# EAGLE schematic main (EAGLE 8.5.1)

## Sheet 1 of 2
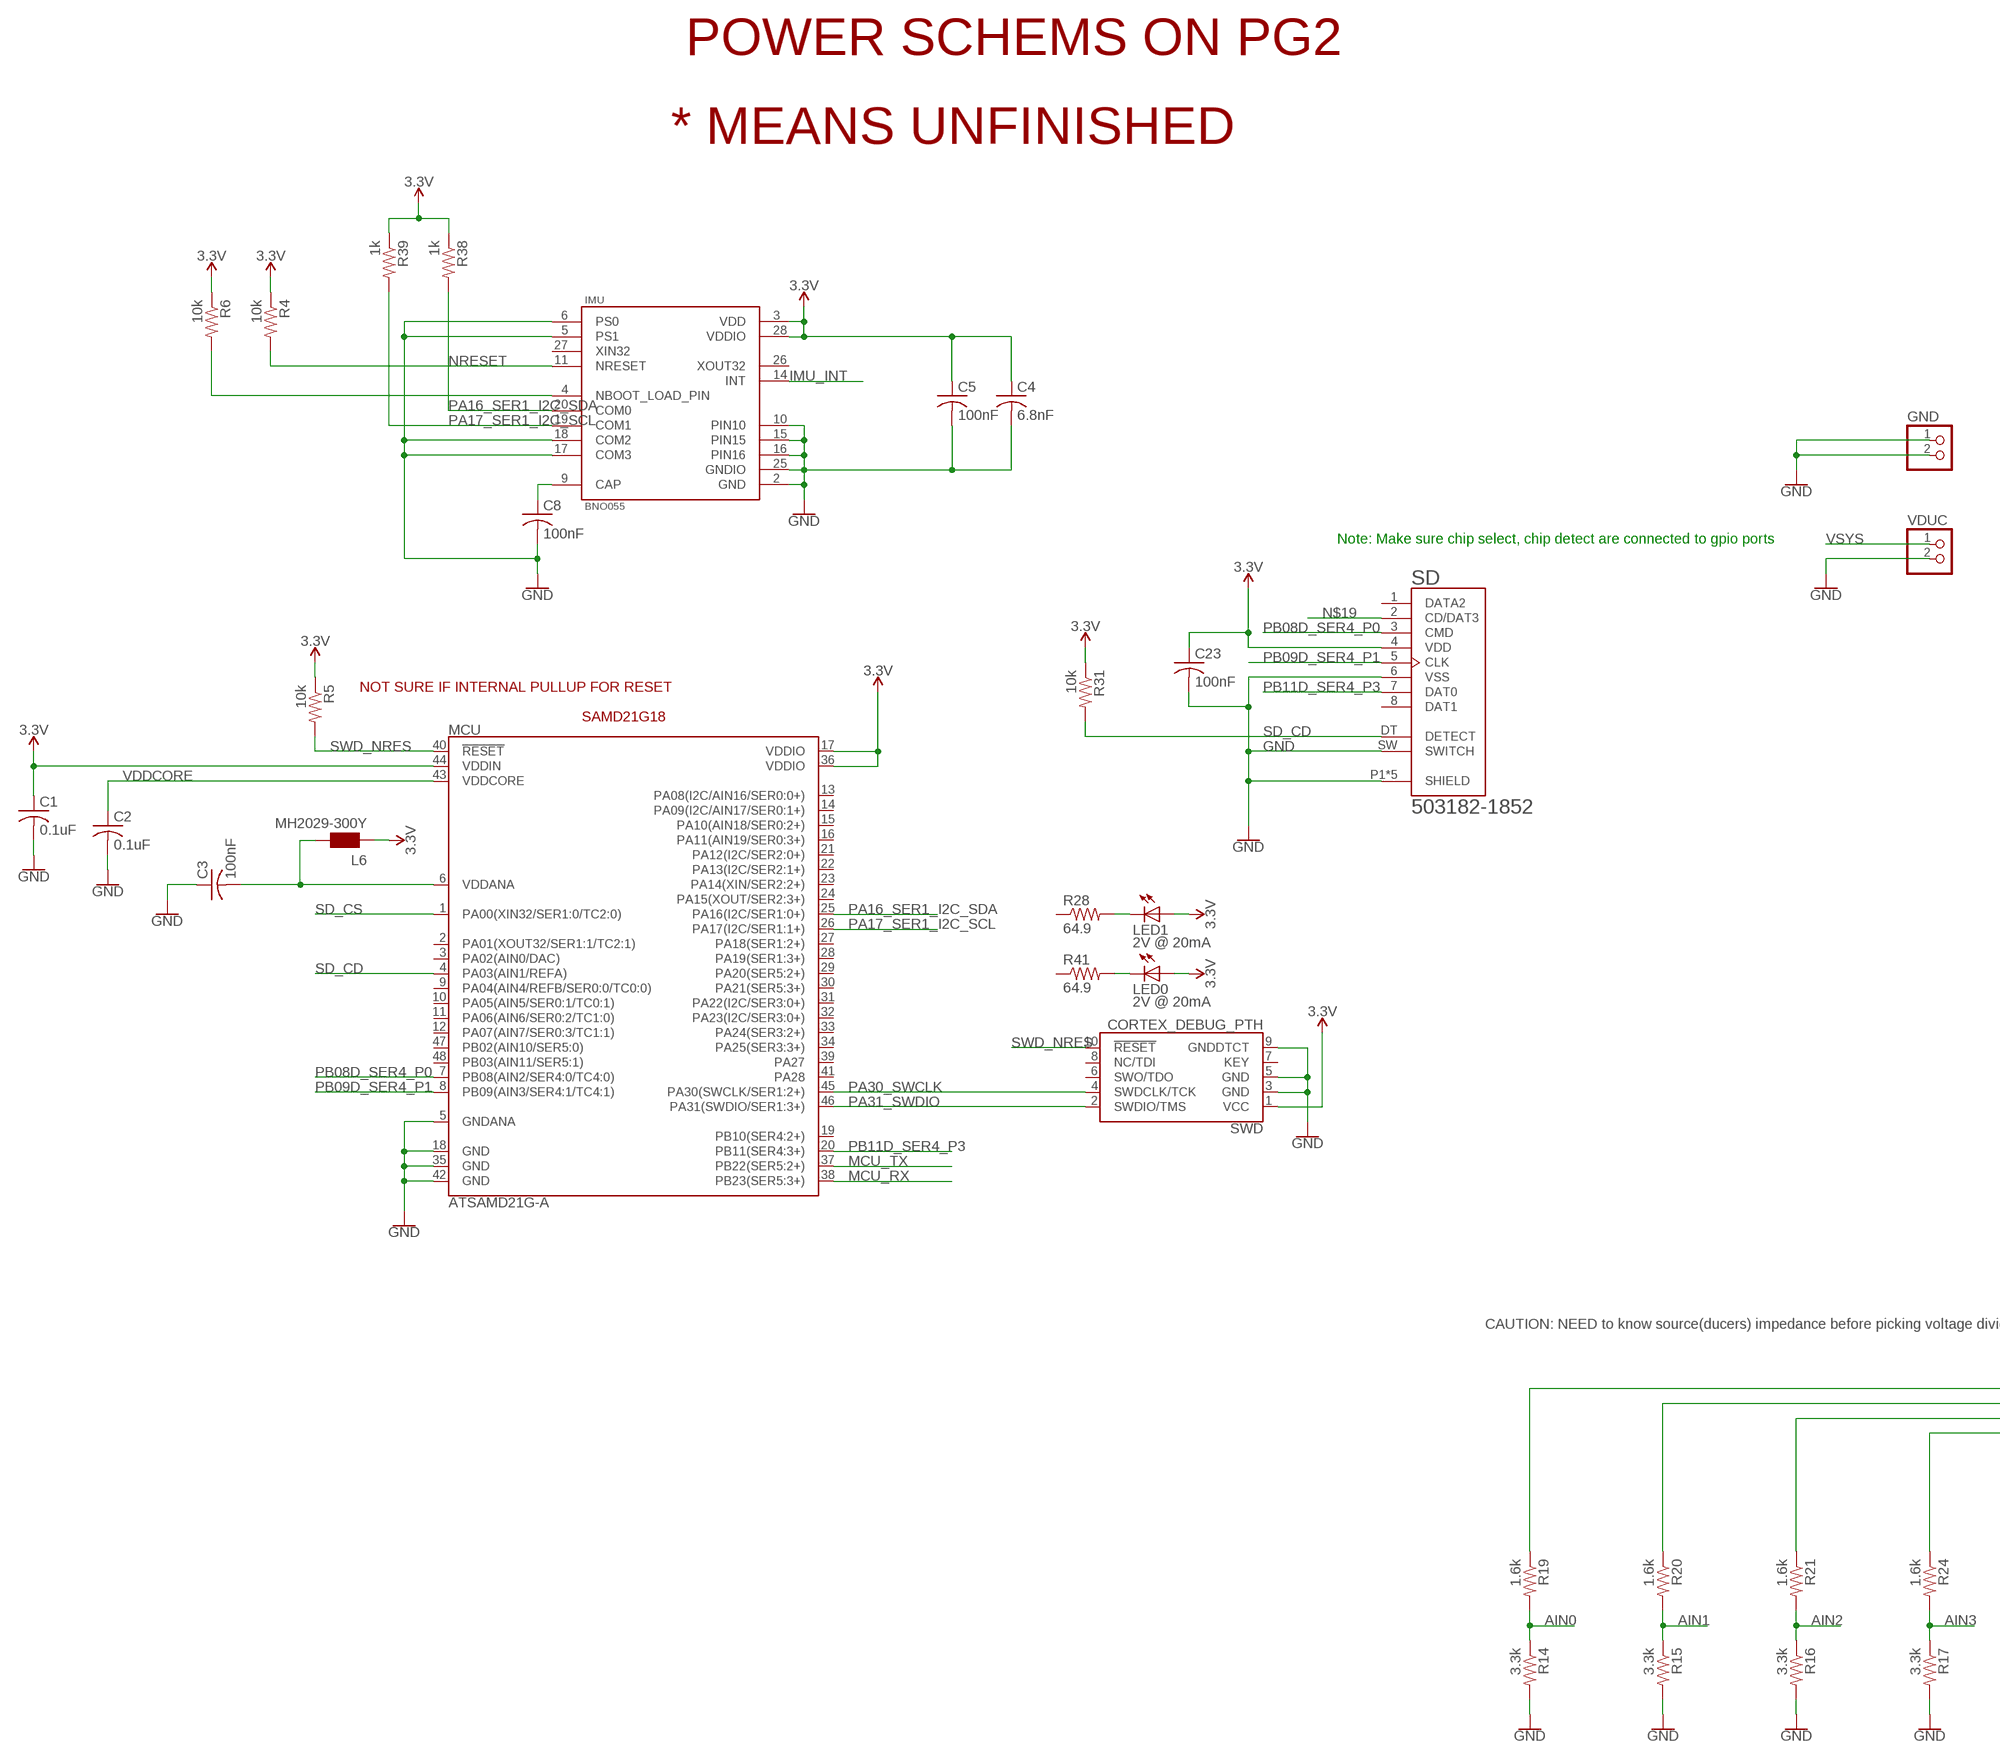
[diagram p0: schematic, sheet 1, part 1 of 2]
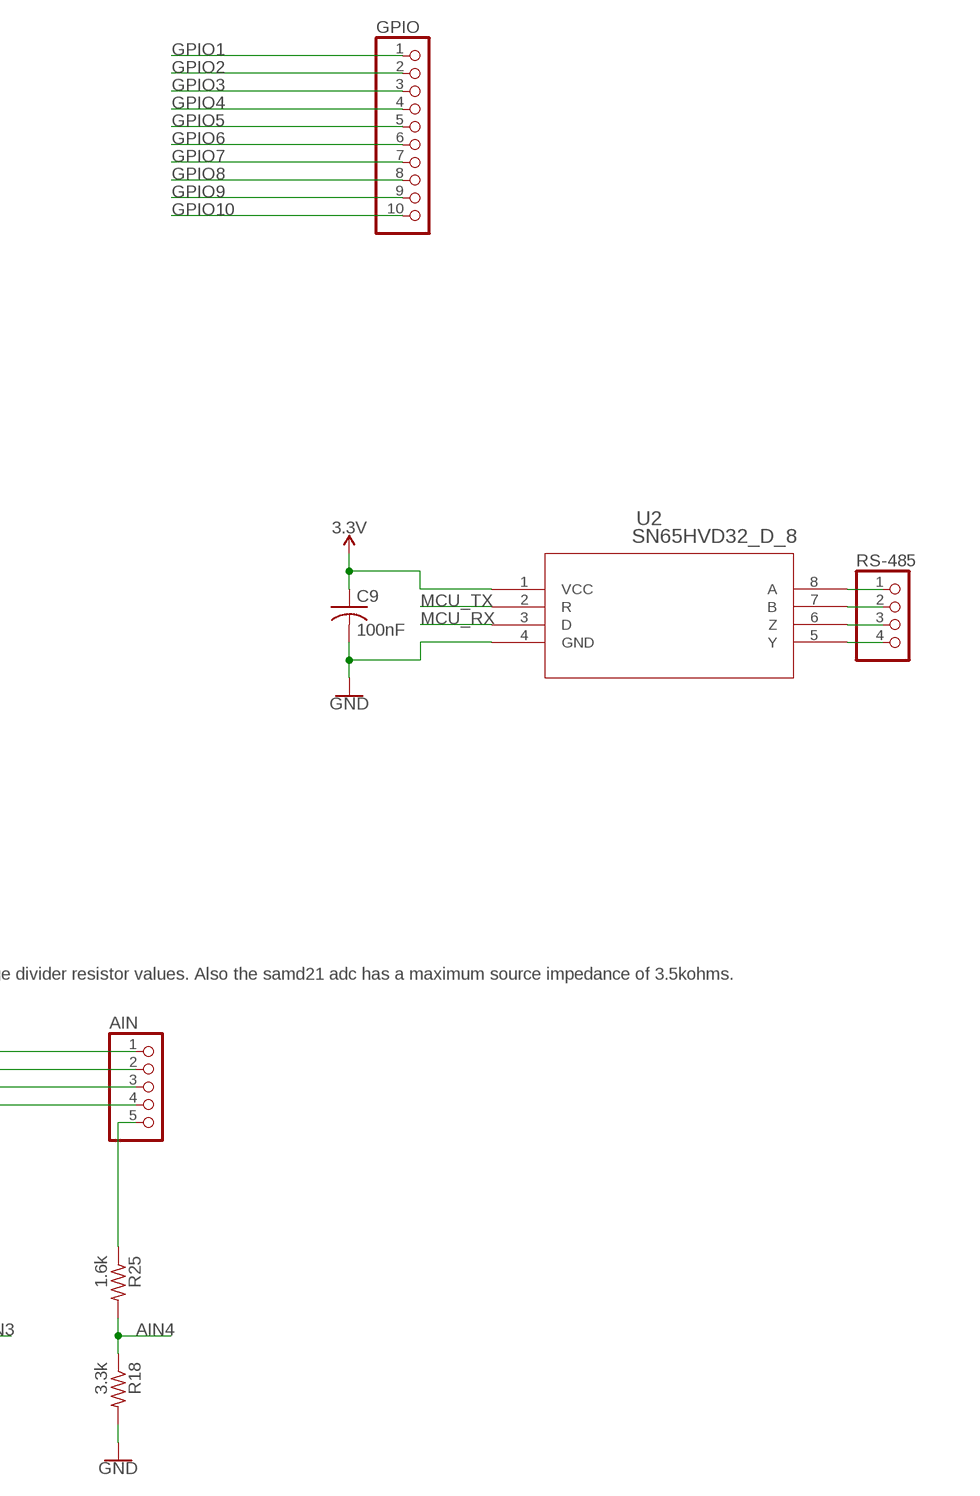
[diagram p1: schematic, sheet 1, part 2 of 2]

### Parts
AIN  PINHD-1X5  [1X05]
C1  0.1uF  C-USC0603  [C0603]
C2  0.1uF  C-USC0603  [C0603]
C3  100nF  C-USC0603  [C0603]
C4  6.8nF  C-USC0603  [C0603]
C5  100nF  C-USC0603  [C0603]
C8  100nF  C-USC0603  [C0603]
C9  100nF  C-USC0603  [C0603]
C23  100nF  C-USC0603  [C0603]
GND  PINHD-1X2  [1X02]
GPIO  PINHD-1X10  [1X10]
IMU  BNO055  [LGA28R50P4X10_380X520X100]
L6  MH2029-300Y  0001_BLM21PG300SN1D_/_MH2029-300Y  [0805]
LED0  2V @ 20mA  LEDCHIPLED_0603  [CHIPLED_0603]
LED1  2V @ 20mA  LEDCHIPLED_0603  [CHIPLED_0603]
MCU  ATSAMD21G-A  [TQFP-48]
R4  10k  R-US_R0603  [R0603]
R5  10k  R-US_R0603  [R0603]
R6  10k  R-US_R0603  [R0603]
R14  3.3k  R-US_R0603  [R0603]
R15  3.3k  R-US_R0603  [R0603]
R16  3.3k  R-US_R0603  [R0603]
R17  3.3k  R-US_R0603  [R0603]
R18  3.3k  R-US_R0603  [R0603]
R19  1.6k  R-US_R0603  [R0603]
R20  1.6k  R-US_R0603  [R0603]
R21  1.6k  R-US_R0603  [R0603]
R24  1.6k  R-US_R0603  [R0603]
R25  1.6k  R-US_R0603  [R0603]
R28  64.9  R-US_R0603  [R0603]
R31  10k  R-US_R0603  [R0603]
R38  1k  R-US_R0603  [R0603]
R39  1k  R-US_R0603  [R0603]
R41  64.9  R-US_R0603  [R0603]
RS-485  PINHD-1X4  [1X04]
SD  503182-1852  [MOLEX_503182-1852]
SWD  CORTEX_DEBUG_PTH  [2X5-PTH-1.27MM]
U2  SN65HVD32_D_8  [D8]
VDUC  PINHD-1X2  [1X02]

### Nets
3.3V: C1.1 C4.1 C5.1 C9.1 C23.1 IMU.3(VDD) IMU.28(VDDIO) L6.1 LED0.A LED1.A MCU.17(VDDIO) MCU.36(VDDIO) MCU.44(VDDIN) R4.1 R5.1 R6.1 R31.1 R38.1 R39.1 SD.4(VDD) SWD.1(VCC) U2.1(VCC) ; also sheet 2
AIN0: R14.1 R19.2
AIN1: R15.1 R20.2
AIN2: R16.1 R21.2
AIN3: R17.1 R24.2
AIN4: R18.1 R25.2
GND: C1.2 C2.2 C3.1 C4.2 C5.2 C8.2 C9.2 C23.2 GND.1 GND.2 IMU.2(GND) IMU.5(PS1) IMU.6(PS0) IMU.10(PIN10) IMU.15(PIN15) IMU.16(PIN16) IMU.17(COM3) IMU.18(COM2) IMU.25(GNDIO) MCU.5(GNDANA) MCU.18(GND) MCU.35(GND) MCU.42(GND) R14.2 R15.2 R16.2 R17.2 R18.2 SD.6(VSS) SD.P1(SHIELD) SD.P2(SHIELD) SD.P3(SHIELD) SD.P4(SHIELD) SD.P5(SHIELD) SD.SW(SWITCH) SWD.3(GND) SWD.5(GND) SWD.9(GNDDTCT) U2.4(GND) VDUC.2 ; also sheet 2
GPIO1: GPIO.1
GPIO2: GPIO.2
GPIO3: GPIO.3
GPIO4: GPIO.4
GPIO5: GPIO.5
GPIO6: GPIO.6
GPIO7: GPIO.7
GPIO8: GPIO.8
GPIO9: GPIO.9
GPIO10: GPIO.10
IMU_INT: IMU.14(INT)
MCU_RX: MCU.38(PB23(SER5:3+)) U2.3(D)
MCU_TX: MCU.37(PB22(SER5:2+)) U2.2(R)
N$1: AIN.2 R20.1
N$2: C3.2 L6.2 MCU.6(VDDANA)
N$3: AIN.3 R21.1
N$4: AIN.4 R24.1
N$5: AIN.5 R25.1
N$6: RS-485.1 U2.8(A)
N$7: LED0.C R41.2
N$8: AIN.1 R19.1
N$9: C8.1 IMU.9(CAP)
N$11: RS-485.2 U2.7(B)
N$12: RS-485.3 U2.6(Z)
N$13: RS-485.4 U2.5(Y)
N$18: IMU.4(NBOOT_LOAD_PIN) R6.2
N$19: SD.2(CD/DAT3)
N$20: LED1.C R28.2
NRESET: IMU.11(NRESET) R4.2
PA16_SER1_I2C_SDA: IMU.20(COM0) MCU.25(PA16(I2C/SER1:0+)) R38.2
PA17_SER1_I2C_SCL: IMU.19(COM1) MCU.26(PA17(I2C/SER1:1+)) R39.2
PA30_SWCLK: MCU.45(PA30(SWCLK/SER1:2+)) SWD.4(SWDCLK/TCK)
PA31_SWDIO: MCU.46(PA31(SWDIO/SER1:3+)) SWD.2(SWDIO/TMS)
PB08D_SER4_P0: MCU.7(PB08(AIN2/SER4:0/TC4:0)) SD.3(CMD)
PB09D_SER4_P1: MCU.8(PB09(AIN3/SER4:1/TC4:1)) SD.5(CLK)
PB11D_SER4_P3: MCU.20(PB11(SER4:3+)) SD.7(DAT0)
SD_CD: MCU.4(PA03(AIN1/REFA)) R31.2 SD.DT(DETECT)
SD_CS: MCU.1(PA00(XIN32/SER1:0/TC2:0))
SWD_NRES: MCU.40(!RESET!) R5.2 SWD.10(!RESET)
VDDCORE: C2.1 MCU.43(VDDCORE)
VSYS: VDUC.1 ; also sheet 2
Unconnected: IMU.26(XOUT32) IMU.27(XIN32) MCU.2(PA01(XOUT32/SER1:1/TC2:1)) MCU.3(PA02(AIN0/DAC)) MCU.9(PA04(AIN4/REFB/SER0:0/TC0:0)) MCU.10(PA05(AIN5/SER0:1/TC0:1)) MCU.11(PA06(AIN6/SER0:2/TC1:0)) MCU.12(PA07(AIN7/SER0:3/TC1:1)) MCU.13(PA08(I2C/AIN16/SER0:0+)) MCU.14(PA09(I2C/AIN17/SER0:1+)) MCU.15(PA10(AIN18/SER0:2+)) MCU.16(PA11(AIN19/SER0:3+)) MCU.19(PB10(SER4:2+)) MCU.21(PA12(I2C/SER2:0+)) MCU.22(PA13(I2C/SER2:1+)) MCU.23(PA14(XIN/SER2:2+)) MCU.24(PA15(XOUT/SER2:3+)) MCU.27(PA18(SER1:2+)) MCU.28(PA19(SER1:3+)) MCU.29(PA20(SER5:2+)) MCU.30(PA21(SER5:3+)) MCU.31(PA22(I2C/SER3:0+)) MCU.32(PA23(I2C/SER3:0+)) MCU.33(PA24(SER3:2+)) MCU.34(PA25(SER3:3+)) MCU.39(PA27) MCU.41(PA28) MCU.47(PB02(AIN10/SER5:0)) MCU.48(PB03(AIN11/SER5:1)) R28.1 R41.1 SD.1(DATA2) SD.8(DAT1) SWD.6(SWO/TDO) SWD.7(KEY) SWD.8(NC/TDI)

### Notes on the sheet
- POWER SCHEMS ON PG2
- * MEANS UNFINISHED
- Note: Make sure chip select, chip detect are connected to gpio ports
- NOT SURE IF INTERNAL PULLUP FOR RESET
- SAMD21G18
- CAUTION: NEED to know source(ducers) impedance before picking voltage divider resistor values. Also the samd21 adc has a maximum source impedance of 3.5kohms.

## Sheet 2 of 2
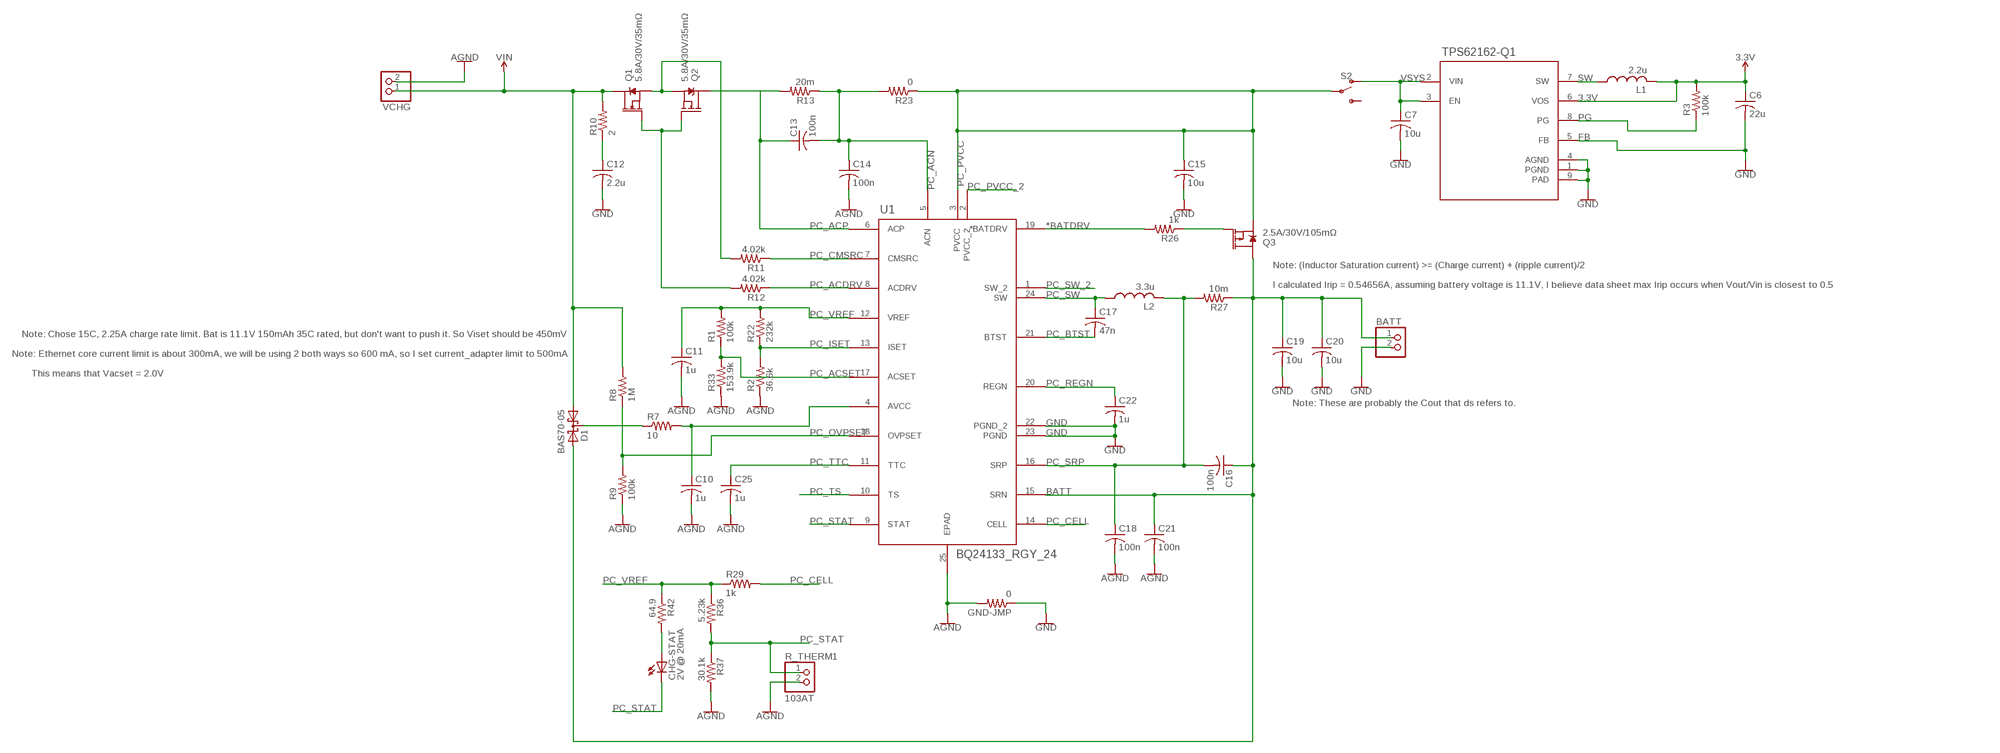
[diagram p2: schematic, sheet 2]

### Parts
BATT  PINHD-1X2  [1X02]
C6  22u  C-USC0603  [C0603]
C7  10u  C-USC1206  [C1206]
C10  1u  C-USC0603  [C0603]
C11  1u  C-USC0603  [C0603]
C12  2.2u  C-USC0603  [C0603]
C13  100n  C-USC0603  [C0603]
C14  100n  C-USC0603  [C0603]
C15  10u  C-USC0603  [C0603]
C16  100n  C-USC0603  [C0603]
C17  47n  C-USC0603  [C0603]
C18  100n  C-USC0603  [C0603]
C19  10u  C-USC0603  [C0603]
C20  10u  C-USC0603  [C0603]
C21  100n  C-USC0603  [C0603]
C22  1u  C-USC0603  [C0603]
C25  1u  C-USC0603  [C0603]
CHG-STAT  2V @ 20mA  LEDCHIPLED_0603  [CHIPLED_0603]
D1  BAS70-05  [SOT23]
GND-JMP  0  R-US_R0603  [R0603]
L1  2.2u  L-USL2012C  [L2012C]
L2  3.3u  L-USL3225M  [L3225M]
Q1  5.8A/30V/35mΩ  MOSFET-NCH-AO3404A  [SOT23-3]
Q2  5.8A/30V/35mΩ  MOSFET-NCH-AO3404A  [SOT23-3]
Q3  2.5A/30V/105mΩ  MOSFET_PCH-DMG2307L  [SOT23-3]
R1  100k  R-US_R0603  [R0603]
R2  36.6k  R-US_R0603  [R0603]
R3  100k  R-US_R0603  [R0603]
R7  10  R-US_R0603  [R0603]
R8  1M  R-US_R0603  [R0603]
R9  100k  R-US_R0603  [R0603]
R10  2  R-US_R0603  [R0603]
R11  4.02k  R-US_R0603  [R0603]
R12  4.02k  R-US_R0603  [R0603]
R13  20m  R-US_R0603  [R0603]
R22  232k  R-US_R0603  [R0603]
R23  0  R-US_R0603  [R0603]
R26  1k  R-US_R0603  [R0603]
R27  10m  R-US_R0603  [R0603]
R29  1k  R-US_R0603  [R0603]
R33  153.9k  R-US_R0603  [R0603]
R36  5.23k  R-US_R0603  [R0603]
R37  30.1k  R-US_R0603  [R0603]
R42  64.9  R-US_R0603  [R0603]
R_THERM1  103AT  PINHD-1X2  [1X02]
S2  SWITCH-SPDT-SMD-AYZ0202  [SWITCH_DPDT_SMD_AYZ0202]
TPS62162-Q1  TPS62162QDSGRQ1  [DSG0008A]
U1  BQ24133_RGY_24  [RGY24_2P05X3P1]
VCHG  PINHD-1X2  [1X02]

### Nets
3.3V: C6.1 L1.2 R3.2 TPS62162-Q1.6(VOS) ; also sheet 1
*BATDRV: R26.2 U1.19(*BATDRV)
AGND: C10.2 C11.2 C14.2 C18.2 C21.2 C25.2 GND-JMP.2 R2.1 R9.1 R33.1 R37.2 R_THERM1.2 U1.25(EPAD) VCHG.2
BATT: BATT.1 C16.1 C19.1 C20.1 C21.1 D1.2(A2) Q3.3(D) R27.1 U1.15(SRN)
FB: C6.2 TPS62162-Q1.5(FB) ; supply symbol labelled GND
GND: BATT.2 C7.2 C12.2 C15.2 C19.2 C20.2 C22.2 GND-JMP.1 TPS62162-Q1.1(PGND) TPS62162-Q1.4(AGND) TPS62162-Q1.9(PAD) U1.22(PGND_2) U1.23(PGND) ; also sheet 1
N$10: Q3.1(G) R26.1
N$14: D1.3(C) R7.1
N$15: C12.1 R10.1
N$16: Q1.2(S) Q2.2(S) R11.2
N$17: Q1.1(G) Q2.1(G) R12.2
N$21: C10.1 R7.2 U1.4(AVCC)
N$23: CHG-STAT.A R42.2
PC_ACDRV: R12.1 U1.8(ACDRV)
PC_ACN: C13.2 C14.1 R13.1 R23.2 U1.5(ACN)
PC_ACP: C13.1 Q2.3(D) R13.2 U1.6(ACP)
PC_ACSET: R1.1 R33.2 U1.17(ACSET)
PC_BTST: C17.2 U1.21(BTST)
PC_CELL: R29.2 U1.14(CELL)
PC_CMSRC: R11.1 U1.7(CMSRC)
PC_ISET: R2.2 R22.1 U1.13(ISET)
PC_OVPSET: R8.1 R9.2 U1.18(OVPSET)
PC_PVCC: C15.1 Q3.2(S) R23.1 S2.2(P) U1.3(PVCC)
PC_PVCC_2: U1.2(PVCC_2)
PC_REGN: C22.1 U1.20(REGN)
PC_SRP: C16.2 C18.1 L2.2 R27.2 U1.16(SRP)
PC_STAT: CHG-STAT.C R36.2 R37.1 R_THERM1.1 U1.9(STAT)
PC_SW: C17.1 L2.1 U1.24(SW)
PC_SW_2: U1.1(SW_2)
PC_TS: U1.10(TS)
PC_TTC: C25.1 U1.11(TTC)
PC_VREF: C11.1 R1.2 R22.2 R29.1 R36.1 R42.1 U1.12(VREF)
PG: R3.1 TPS62162-Q1.8(PG)
SW: L1.1 TPS62162-Q1.7(SW)
VIN: D1.1(A1) Q1.3(D) R8.2 R10.2 VCHG.1
VSYS: C7.1 S2.1(O) TPS62162-Q1.2(VIN) TPS62162-Q1.3(EN) ; also sheet 1
Unconnected: S2.3(S)

### Notes on the sheet
- Note: (Inductor Saturation current) >= (Charge current) + (ripple current)/2
- I calculated Irip = 0.54656A, assuming battery voltage is 11.1V, I believe data sheet max Irip occurs when Vout/Vin is closest to 0.5
- Note: Chose 15C, 2.25A charge rate limit. Bat is 11.1V 150mAh 35C rated, but don't want to push it. So Viset should be 450mV
- Note: Ethernet core current limit is about 300mA, we will be using 2 both ways so 600 mA, so I set current_adapter limit to 500mA
- This means that Vacset = 2.0V
- Note: These are probably the Cout that ds refers to.

## Library data of the parts
AIN = pinhead:PINHD-1X5: PIN HEADER
BATT GND R_THERM1 VCHG VDUC = pinhead:PINHD-1X2: PIN HEADER
C1-C6 C8-C23 C25 = resistor:C-US: CAPACITOR, American symbol
C7 = rcl:C-US: CAPACITOR, American symbol; SPICEPREFIX: C
CHG-STAT LED0 LED1 = adafruit:LED: LED OSRAM: - CHIPLED LG R971, LG N971, LY N971, LG Q971, LY Q971, LO R971, LY R971 LH N974, LH R974 LS Q976, LO Q976, LY Q976 LO Q996 - Hyper CHIPLED LW Q18S LB Q993, LB Q99A, LB R99A - SideLED LS A670, LO A670, LY A670, LG A670, LP A670 LB A673, LV A673, LT A673, LW A673 LH A674 LY A675 LS A676, LA A676, LO A676, LY A676, LW A676 LS A679, LY A679, LG A679 - Hyper Micro SIDELED® LS Y876, LA Y876, LO Y876, LY Y876 LT Y87S - SmartLED LW L88C, LW L88S LB L89C, LB L89S, LG L890 LS L89K, LO L89K, LY L89K LS L896, LA L896, LO L896, LY L896 - TOPLED LS T670, LO T670, LY T670, LG T670, LP T670 LSG T670, LSP T670, LSY T670, LOP T670, LYG T670 LG T671, LOG T671, LSG T671 LB T673, LV T673, LT T673, LW T673 LH T674 LS T676, LA T676, LO T676, LY T676, LB T676, LH T676, LSB T676, LW T676 LB T67C, LV T67C, LT T67C, LS T67K, LO T67K, LY T67K, LW E67C LS E67B, LA E67B, LO E67B, LY E67B, LB E67C, LV E67C, LT E67C LW T67C LS T679, LY T679, LG T679 LS T770, LO T770, LY T770, LG T770, LP T770 LB T773, LV T773, LT T773, LW T773 LH T774 LS E675, LA E675, LY E675, LS T675 LS T776, LA T776, LO T776, LY T776, LB T776 LHGB T686 LT T68C, LB T68C - Hyper Mini TOPLED® LB M676 - Mini TOPLED Santana® LG M470 LS M47K, LO M47K, LY M47K Source: http://www.osram.convergy.de/
D1 = diode:BAS70-05: Silicon Schottky Diodes General-purpose diode for high-speed switching
GND-JMP R1-R29 R31 R33 R36-R39 R41 R42 = resistor:R-US_: RESISTOR, American symbol
GPIO = pinhead:PINHD-1X10: PIN HEADER
IMU = BNO055:BNO055: BNO055 9-axis Absolute Orientation Sensor ( SiP ) w/Sensors and Sensor Fusion; AVAILABILITY: Good; DESCRIPTION: IMU ACCEL/GYRO/MAG I2C 28LGA; MF: Bosch; MP: BNO055; PACKAGE: LGA-28 Bosch; PRICE: 7.78 USD
L1 = resistor:L-US: INDUCTOR, American symbol
L2 = rcl:L-US: INDUCTOR, American symbol; SPICEPREFIX: L
L6 = Protezione:0001_BLM21PG300SN1D_/_MH2029-300Y: BLM21; MONTHLY_USAGE: _____; PART_NUMBER: BLM21PG300SN1D_/_MH2029-300Y; PRICE: _____; SUPPLIER: _____; TYPE: Protezione
MCU = SparkFun-IC-Microcontroller:ATSAMD21G: Atmel SAMD21G SMART ARM-Based Microcontroller The Atmel ® | SMART ™ SAM D21 is a series of low-power microcontrollers using the 32-bit ARM ® Cortex ® -M0+ processor, and ranging from 32- to 64-pins with up to 256KB Flash and 32KB of SRAM. The SAM D21 devices operate at a maximum frequency of 48MHz and reach 2.46 CoreMark/MHz. They are designed for simple and intuitive migration with identical peripheral modules, hex compatible code, identical linear address map and pin compatible migration paths between all devices in the product series. All devices include intelligent and flexible peripherals, Atmel Event System for inter-peripheral signaling, and support for capacitive touch button, slider and wheel user interfaces. Datasheet <https://cdn.sparkfun.com/datasheets/Dev/Arduino/Boards/Atmel-42181-SAM-D21_Datasheet.pdf> SparkFun Products SparkFun SAMD21 Mini Breakout <https://www.sparkfun.com/products/13664> (DEV-13664) SparkFun SAMD21 Dev Breakout <https://www.sparkfun.com/products/13672> (DEV-13672); PROD_ID: IC-13064
Q1 = SparkFun-DiscreteSemi:MOSFET-NCH: N-channel MOSFETs Voltage controlled devices that allow control of high current outputs. SparkFun Products: SparkFun OpenScale <https://www.sparkfun.com/products/13261> SparkFun Digital Sandbox <https://www.sparkfun.com/products/12651> SparkFun Monster Moto Shield <https://www.sparkfun.com/products/10182> SparkFun MOSFET Power Controller <https://www.sparkfun.com/products/11214>; PROD_ID: TRANS-12988; SPICEPREFIX: Q
Q2 = SparkFun-DiscreteSemi:MOSFET-NCH: N-channel MOSFETs Voltage controlled devices that allow control of high current outputs. SparkFun Products: SparkFun OpenScale <https://www.sparkfun.com/products/13261> SparkFun Digital Sandbox <https://www.sparkfun.com/products/12651> SparkFun Monster Moto Shield <https://www.sparkfun.com/products/10182> SparkFun MOSFET Power Controller <https://www.sparkfun.com/products/11214>; PROD_ID: TRANS-12988
Q3 = SparkFun-DiscreteSemi:MOSFET_PCH: P-channel MOSFETs Voltage controlled devices that allow control of high current outputs. SparkFun Products: SparkFun ESP32 Thing <https://www.sparkfun.com/products/13907> SparkFun ESP8266 Thing <https://www.sparkfun.com/products/13231>; PROD_ID: TRANS-11308
RS-485 = pinhead:PINHD-1X4: PIN HEADER
S2 = SparkFun-Switches:SWITCH-SPDT: Single Pole, Double Throw (SPDT) Switch Single-pole, double-throw (SPDT) switch. Variant Overview SMD-AYZ0202 Surface Mount DPDT Switch <https://www.sparkfun.com/products/597> (COM-00597) Used on e.g. LilyPad Arduino USB - ATmega32U4 Board <https://www.sparkfun.com/products/12049> PTH-11.6X4.0MM SPDT Mini Power Switch <https://www.sparkfun.com/products/102> (COM-00102) Used on e.g. SparkFun Simon Says - Through-Hole Soldering Kit <https://www.sparkfun.com/products/10547> (KIT-10547) PTH-11.6X4.0MM-KIT KIT version of SPDT Mini Power Switch - Simplifies soldering by removing tStop of switch pins - only one side can be soldered. PTH-11.6X4.0MM-LOCK LOCK version of SPDT Mini Power Switch - Offset pins hold switch in place for easier soldering. SMD-RIGHT-ANGLE Surface Mount Right Angle Switch <https://www.sparkfun.com/products/10860> (COM-10860) Used on e.g. SparkFun ESP8266 Thing <https://www.sparkfun.com/products/13231>; PROD_ID: SWCH-08179; SF_ID: COM-00597
SD = molex-microSD:503182-1852: Conn Micro SD Card M 8 POS 1.09mm Solder RA SMD Embossed T/R 0.5A/Contact; DESCRIPTION: MICRO SD NORMAL ULTRALOWPRO8CKTE; DIGI-KEY_PART_NUMBER: WM12834CT-ND; DIGI-KEY_PURCHASE_URL: https://www.digikey.com/product-detail/en/molex-llc/5031821852/WM12834CT-ND/5823232?WT.z_cid=ref_snapeda&utm_source=snapeda&utm_medium=aggregator&utm_campaign=buynow; MF: Molex; MP: 5031821852; PACKAGE: None
SWD = SparkFun-Connectors:CORTEX_DEBUG: Cortex Debug Connector - 10 pin Supports JTAG debug, Serial Wire debug, and Serial Wire Viewer. PTH and SMD connector options available. General Connector Information <http://infocenter.arm.com/help/topic/com.arm.doc.faqs/attached/13634/cortex_debug_connectors.pdf> Products: PTH Connector <http://www.digikey.com/product-detail/en/cnc-tech/3220-10-0100-00/1175-1627-ND/3883661> -via Digi-Key SparkFun PSoc <https://www.sparkfun.com/products/13229> SparkFun T <https://www.sparkfun.com/products/13810>
TPS62162-Q1 = TPS62162-Q1:TPS62162QDSGRQ1; MANUFACTURER: Texas Instruments; PARTNUMBER: TPS62162QDSGRQ1; REFDES: RefDes; TYPE: TYPE; VALUE: Value
U1 = BQ24133-UPDATED:BQ24133_RGY_24; DATASHEETURL: httpwww.ti.comlitgpnBQ24133; FAMILY_NAME: BATTERY CHARGE MANAGEMENT; GENERIC_PART_NUMBER: BQ24133; INDUSTRY_STD_PKG_TYPE: VQFN; MANUFACTURER: Texas Instruments; PACKAGE_DESIGNATOR: RGY; PIN_COUNT: 24
U2 = SN65HVD32:SN65HVD32_D_8; DATASHEETURL: httpwww.ti.comlitgpnSN65HVD32; FAMILY_NAME: RS485; GENERIC_PART_NUMBER: SN65HVD32; INDUSTRY_STD_PKG_TYPE: SOIC; MANUFACTURER: Texas Instruments; MANUFACTURER_PART_NUMBER: sn65hvd32_d_8; PACKAGE_DESIGNATOR: D; PIN_COUNT: 8; VENDOR: Texas Instruments